# EAGLE design V1.0 (EAGLE 6.3)
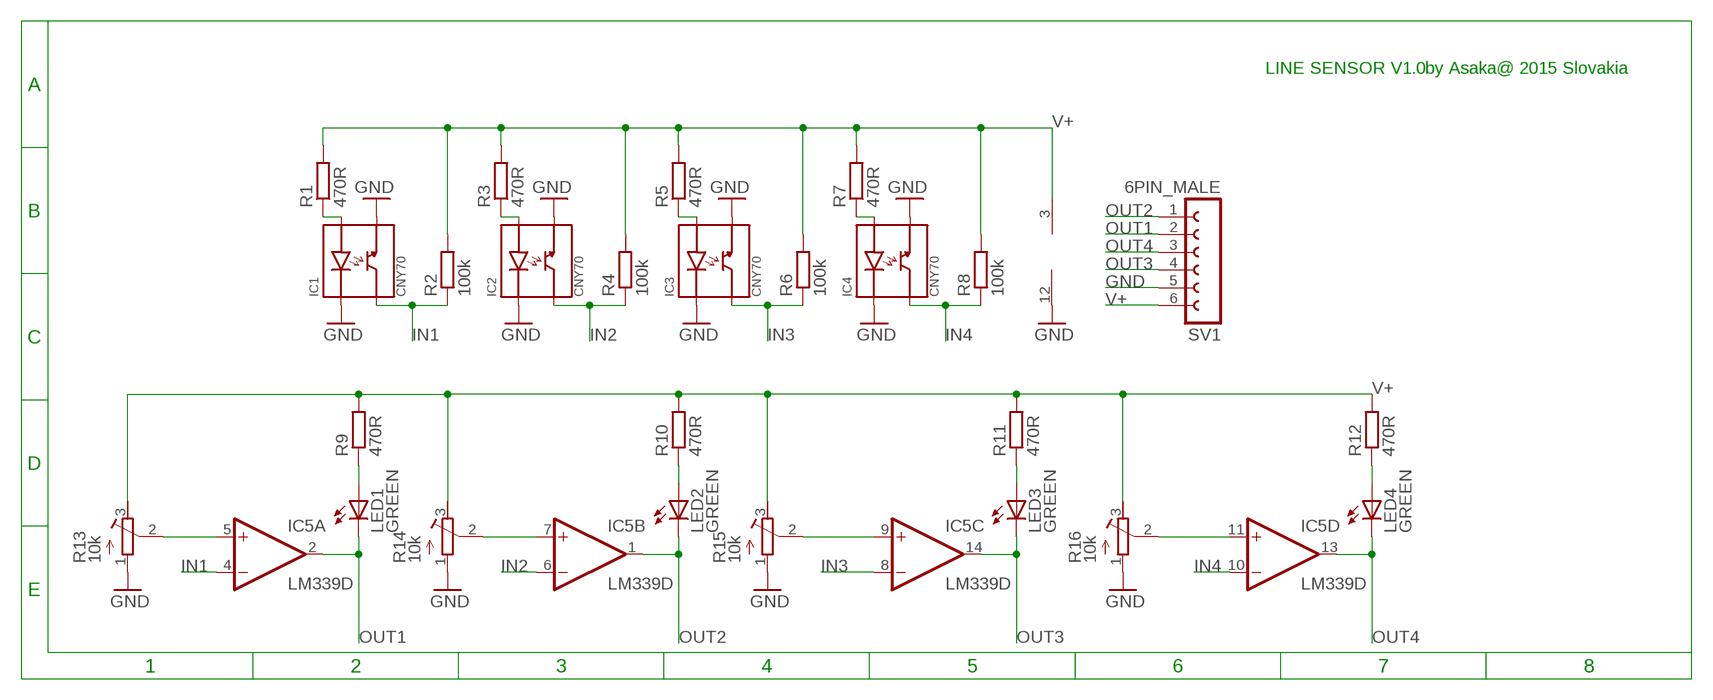
[diagram p0: schematic, sheet 1]

## Parts
IC1  CNY70  [CNY70]
IC2  CNY70  [CNY70]
IC3  CNY70  [CNY70]
IC4  CNY70  [CNY70]
IC5  LM339D  [SO14]
LED1  GREEN  LEDCHIP-LED0805  [CHIP-LED0805]
LED2  GREEN  LEDCHIP-LED0805  [CHIP-LED0805]
LED3  GREEN  LEDCHIP-LED0805  [CHIP-LED0805]
LED4  GREEN  LEDCHIP-LED0805  [CHIP-LED0805]
R1  470R  R-EU_M0805  [M0805]
R2  100k  R-EU_M0805  [M0805]
R3  470R  R-EU_M0805  [M0805]
R4  100k  R-EU_M0805  [M0805]
R5  470R  R-EU_M0805  [M0805]
R6  100k  R-EU_M0805  [M0805]
R7  470R  R-EU_M0805  [M0805]
R8  100k  R-EU_M0805  [M0805]
R9  470R  R-EU_M0805  [M0805]
R10  470R  R-EU_M0805  [M0805]
R11  470R  R-EU_M0805  [M0805]
R12  470R  R-EU_M0805  [M0805]
R13  10k  R-TRIMM3202  [RTRIM3202]
R14  10k  R-TRIMM3202  [RTRIM3202]
R15  10k  R-TRIMM3202  [RTRIM3202]
R16  10k  R-TRIMM3202  [RTRIM3202]
SV1  6PIN_MALE  FE06-1  [FE06]

## Nets
GND: IC1.DE IC1.EK IC2.DE IC2.EK IC3.DE IC3.EK IC4.DE IC4.EK IC5.12(P:GND) R13.1(E) R14.1(E) R15.1(E) R16.1(E) SV1.5
IN1: IC1.DC IC5.4(A:-IN) R2.1
IN2: IC2.DC IC5.6(B:-IN) R4.1
IN3: IC3.DC IC5.8(C:-IN) R6.1
IN4: IC4.DC IC5.10(D:-IN) R8.1
N$2: IC5.5(A:+IN) R13.2(S)
N$4: IC5.7(B:+IN) R14.2(S)
N$6: IC5.9(C:+IN) R15.2(S)
N$8: IC5.11(D:+IN) R16.2(S)
N$13: LED1.A R9.1
N$14: LED2.A R10.1
N$15: LED3.A R11.1
N$16: LED4.A R12.1
N$17: IC1.EA R1.1
N$19: IC2.EA R3.1
N$21: IC3.EA R5.1
N$23: IC4.EA R7.1
OUT1: IC5.2(A:OUT) LED1.C SV1.2
OUT2: IC5.1(B:OUT) LED2.C SV1.1
OUT3: IC5.14(C:OUT) LED3.C SV1.4
OUT4: IC5.13(D:OUT) LED4.C SV1.3
V+: IC5.3(P:V+) R1.2 R2.2 R3.2 R4.2 R5.2 R6.2 R7.2 R8.2 R9.2 R10.2 R11.2 R12.2 R13.3(A) R14.3(A) R15.3(A) R16.3(A) SV1.6

## Notes on the sheet
- LINE SENSOR V1.0 | by Asaka | @ 2015 Slovakia

## Library data of the parts
IC1-IC4 = CNY70:CNY70: CNY70 (Vishay) Reflexkoppler
IC5 = linear:LM339: Low Power Low Offset Voltage Quad Comparators with open collector; LM139/LM239/LM339/LM2901/LM3302
LED1-LED4 = led:LED: LED OSRAM: - CHIPLED LG R971, LG N971, LY N971, LG Q971, LY Q971, LO R971, LY R971 LH N974, LH R974 LS Q976, LO Q976, LY Q976 LO Q996 - Hyper CHIPLED LW Q18S LB Q993, LB Q99A, LB R99A - SideLED LS A670, LO A670, LY A670, LG A670, LP A670 LB A673, LV A673, LT A673, LW A673 LH A674 LY A675 LS A676, LA A676, LO A676, LY A676, LW A676 LS A679, LY A679, LG A679 - Hyper Micro SIDELED® LS Y876, LA Y876, LO Y876, LY Y876 LT Y87S - SmartLED LW L88C, LW L88S LB L89C, LB L89S, LG L890 LS L89K, LO L89K, LY L89K LS L896, LA L896, LO L896, LY L896 - TOPLED LS T670, LO T670, LY T670, LG T670, LP T670 LSG T670, LSP T670, LSY T670, LOP T670, LYG T670 LG T671, LOG T671, LSG T671 LB T673, LV T673, LT T673, LW T673 LH T674 LS T676, LA T676, LO T676, LY T676, LB T676, LH T676, LSB T676, LW T676 LB T67C, LV T67C, LT T67C, LS T67K, LO T67K, LY T67K, LW E67C LS E67B, LA E67B, LO E67B, LY E67B, LB E67C, LV E67C, LT E67C LW T67C LS T679, LY T679, LG T679 LS T770, LO T770, LY T770, LG T770, LP T770 LB T773, LV T773, LT T773, LW T773 LH T774 LS E675, LA E675, LY E675, LS T675 LS T776, LA T776, LO T776, LY T776, LB T776 LHGB T686 LT T68C, LB T68C - Hyper Mini TOPLED® LB M676 - Mini TOPLED Santana® LG M470 LS M47K, LO M47K, LY M47K Source: http://www.osram.convergy.de LUXEON: - LUMILED® LXK2-PW12-R00, LXK2-PW12-S00, LXK2-PW14-U00, LXK2-PW14-V00 LXK2-PM12-R00, LXK2-PM12-S00, LXK2-PM14-U00 LXK2-PE12-Q00, LXK2-PE12-R00, LXK2-PE12-S00, LXK2-PE14-T00, LXK2-PE14-U00 LXK2-PB12-K00, LXK2-PB12-L00, LXK2-PB12-M00, LXK2-PB14-N00, LXK2-PB14-P00, LXK2-PB14-Q00 LXK2-PR12-L00, LXK2-PR12-M00, LXK2-PR14-Q00, LXK2-PR14-R00 LXK2-PD12-Q00, LXK2-PD12-R00, LXK2-PD12-S00 LXK2-PH12-R00, LXK2-PH12-S00 LXK2-PL12-P00, LXK2-PL12-Q00, LXK2-PL12-R00 Source: www.luxeon.com KINGBRIGHT: KA-3528ASYC Source: www.kingbright.com
R1-R12 = resistor:R-EU_: RESISTOR, European symbol
R13-R16 = resistor:R-TRIMM: Trimm resistor
SV1 = con-lsta:FE06-1: FEMALE HEADER; OC_FARNELL: unknown; OC_NEWARK: unknown

## Board
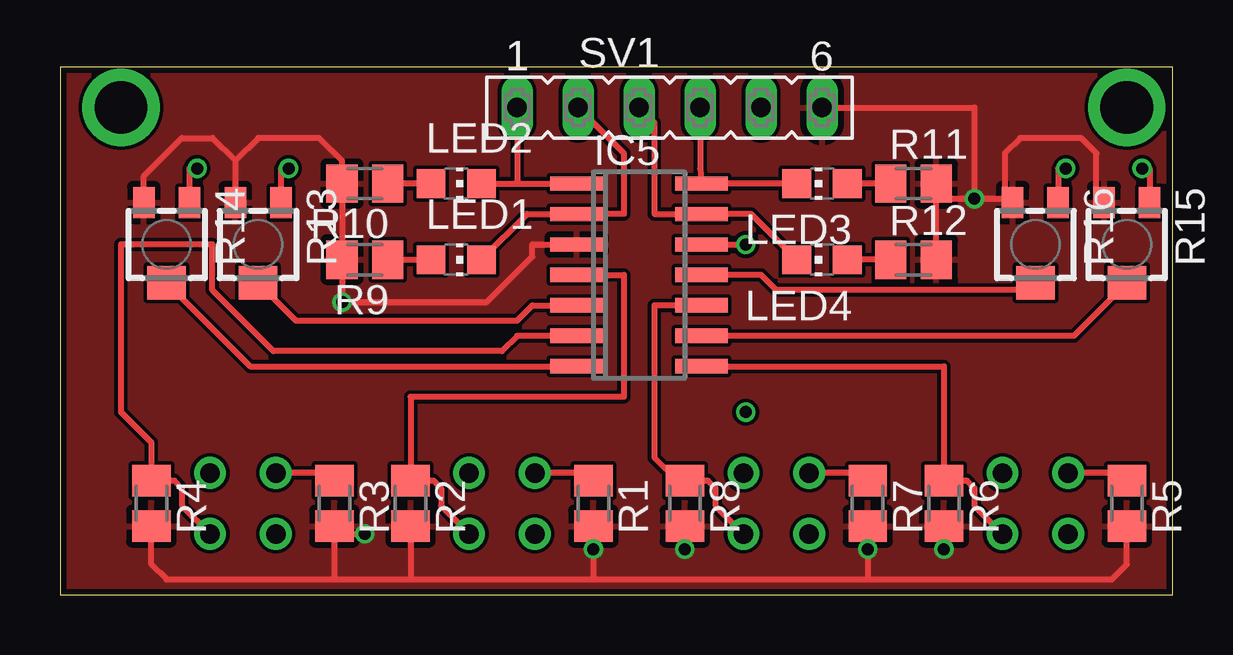
[diagram p1: board, top side]
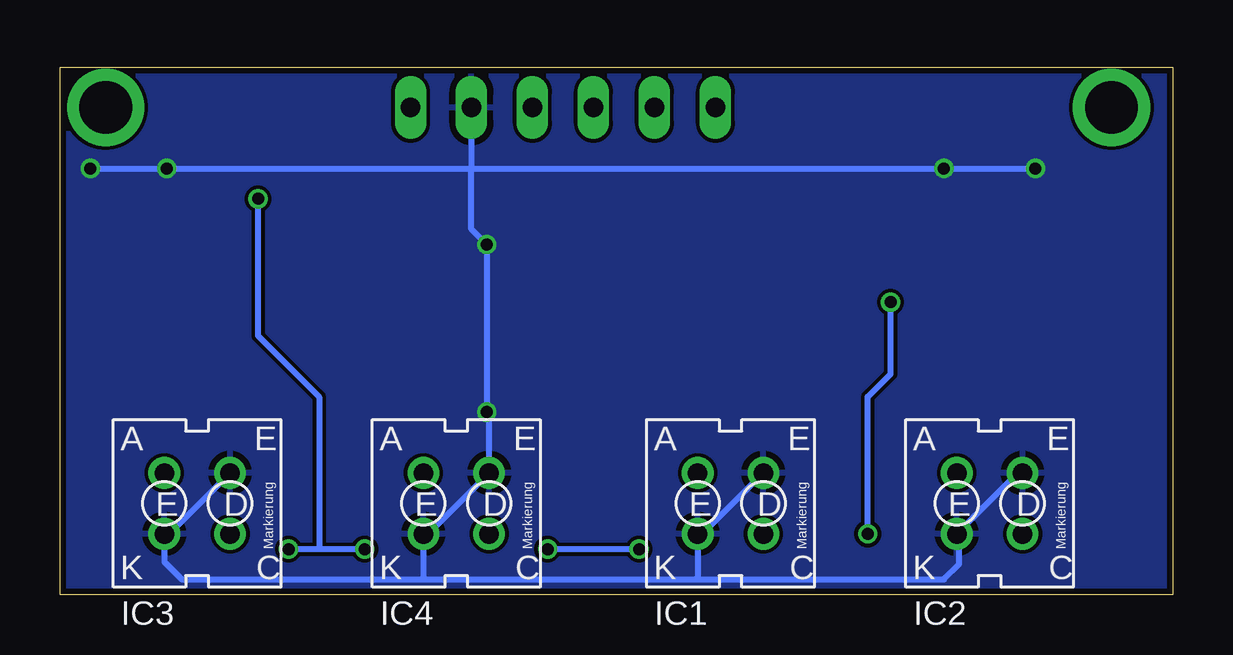
[diagram p2: board, bottom side, seen from below]

Size 46.35 x 22 mm. Coordinates in mm from the lower left corner, seen from the top.
Outline: 0,0 46.35,0 46.35,22 0,22 0,0
Copper layers (1*16): Top 0.035mm / dielectric 1.5mm / Bottom 0.035mm
Design rules "ITEADstudio_DRC *": minimum track width 10mil, minimum drill 12mil, track to track 6mil, track to pad 6mil, pad to pad 6mil, via to via 6mil, smd to smd 0mil, copper to edge 10mil, drill to drill 10mil, minimum pad ring 10mil, minimum via ring 6mil, stop-mask expansion 2mil, vias tented up to drill 100mil, thermal gap 10mil

### Footprints (pad centres in the part's own frame; a part is rotated, then mirrored left to right if it is on the bottom)
CNY70 = drill 0.813: DC 1.37,-1.27; DE 1.37,1.27; EA -1.37,1.27; EK -1.37,-1.27
SO14 = smd 0.6 x 2.2: 1 -3.81,-2.6; 2 -2.54,-2.6; 3 -1.27,-2.6; 4 0,-2.6; 5 1.27,-2.6; 6 2.54,-2.6; 7 3.81,-2.6; 8 3.81,2.6; 9 2.54,2.6; 10 1.27,2.6; 11 0,2.6; 12 -1.27,2.6; 13 -2.54,2.6; 14 -3.81,2.6
CHIP-LED0805 = smd 1.2 x 1.2: A 0,-1.05; C 0,1.05
M0805 = smd 1.3 x 1.6: 1 -0.95,0; 2 0.95,0
RTRIM3202 = smd 0.9 x 1.3: 1 -0.95,-1.75; 3 0.95,-1.75 | smd 1.6 x 1.4: 2 0,1.6
FE06 = drill 0.813 long: 1 -6.35,0; 2 -3.81,0; 3 -1.27,0; 4 1.27,0; 5 3.81,0; 6 6.35,0

### Placement (x,y rotation side)
IC1  18.41,3.81 0 bottom
IC2  7.62,3.81 0 bottom
IC3  40.64,3.81 0 bottom
IC4  29.84,3.81 0 bottom
IC5  24.13,13.34 270 top
LED1  16.51,13.97 270 top
LED2  16.51,17.14 270 top
LED3  31.75,17.14 90 top
LED4  31.75,13.97 90 top
R1  22.23,3.81 270 top
R2  14.61,3.81 270 top
R3  11.43,3.81 270 top
R4  3.81,3.81 270 top
R5  44.45,3.81 270 top
R6  36.83,3.81 270 top
R7  33.66,3.81 270 top
R8  26.04,3.81 270 top
R9  12.7,13.97 180 top
R10  12.7,17.14 180 top
R11  35.56,17.14 0 top
R12  35.56,13.97 0 top
R13  8.26,14.61 180 top
R14  4.45,14.61 180 top
R15  44.45,14.61 180 top
R16  40.64,14.61 180 top
SV1  25.4,20.32 0 top

### Tracks (layer width: path | path; a pad name or v marks a point on that pad's centre or on a via)
GND  (via drill 0.5)
  Top 0.254: v5.71,17.78 5.39,17.78 R14.1 | v9.53,17.78 9.21,17.78 R13.1 | v41.91,17.78 41.59,17.78 R16.1 | v45.09,17.78 45.41,17.78 R15.1 | IC5.12 v28.57,14.61
  Bottom 0.254: SV1.5 29.21,17.78 | 29.21,17.78 v9.53,17.78 v5.71,17.78 | v45.09,17.78 v41.91,17.78 29.21,17.78 | 29.21,17.78 29.21,15.24 v28.57,14.61 v28.57,7.62 28.48,7.52 IC4.DE 31.02,2.54 IC4.EK 31.21,0.73 31.11,0.64 | 31.11,0.64 41.27,0.64 42.01,1.37 IC3.EK 41.81,2.54 IC3.DE | 31.11,0.64 19.68,0.64 | 19.68,0.64 9.53,0.64 8.89,1.27 8.89,2.44 IC2.EK 6.45,5.08 IC2.DE | 19.68,0.64 19.79,0.73 IC1.EK 19.59,2.54 IC1.DE
  pour Bottom: 0,22.23 46.35,22.23 46.35,0 0,0
IN1
  Top 0.254: IC5.4 23.5,13.34 23.5,8.26 14.61,8.26 R2.1 15.56,4.76 15.88,4.45 15.88,3.71 IC1.DC
IN2
  Top 0.254: IC5.6 19.05,10.79 18.41,10.16 8.89,10.16 6.35,12.7 6.35,14.61 2.54,14.61 2.54,7.62 3.81,6.35 R4.1 4.76,4.76 5.08,4.45 5.08,3.71 IC2.DC
IN3
  Top 0.254: IC3.DC 38.1,3.71 38.1,4.45 37.78,4.76 R6.1 36.83,9.53 IC5.8
IN4
  Top 0.254: IC5.10 24.77,12.06 24.77,5.71 25.72,4.76 R8.1 26.99,4.76 27.3,4.45 27.3,3.71 IC4.DC
N$1  (via drill 2.2)
  other vias: 2.54,20.32
N$2
  Top 0.254: R13.2 9.83,11.43 19.05,11.43 19.68,12.06 IC5.5
N$3  (via drill 2.2)
  other vias: 44.45,20.32
N$4
  Top 0.254: R14.2 7.92,9.53 IC5.7
N$6
  Top 0.254: R15.2 42.24,10.79 IC5.9
N$8
  Top 0.254: R16.2 40.34,12.7 29.84,12.7 29.21,13.34 IC5.11
N$13
  Top 0.254: R9.1 LED1.A
N$14
  Top 0.254: LED2.A R10.1
N$15
  Top 0.254: R11.1 LED3.A
N$16
  Top 0.254: R12.1 LED4.A
N$17
  Top 0.254: R1.1 21.91,5.08 IC1.EA
N$19
  Top 0.254: R3.1 11.11,5.08 IC2.EA
N$21
  Top 0.254: R5.1 44.13,5.08 IC3.EA
N$23
  Top 0.254: R7.1 33.34,5.08 IC4.EA
OUT1
  Top 0.254: LED1.C 19.46,15.88 IC5.2 23.5,15.88 23.5,18.41 SV1.2
OUT2
  Top 0.254: LED2.C 19.05,17.14 | 19.05,17.14 IC5.1 | SV1.1 19.05,17.14
OUT3
  Top 0.254: LED3.C IC5.14 26.67,17.78 SV1.4
OUT4
  Top 0.254: LED4.C 28.8,15.88 IC5.13 24.77,15.88 24.77,19.68 SV1.3
V+  (via drill 0.5)
  Top 0.254: 11.43,0.64 4.45,0.64 3.81,1.27 R4.2 | 11.43,0.64 14.61,0.64 | 14.61,0.64 22.23,0.64 | 22.23,0.64 33.66,0.64 | 33.66,0.64 43.81,0.64 44.45,1.27 R5.2 44.77,2.85 | R1.2 v22.23,1.91 22.23,0.64 | R7.2 v33.66,1.91 33.66,0.64 | SV1.6 38.1,20.32 v38.1,16.51 | IC5.3 19.68,14.61 19.68,14.1 17.78,12.2 v11.75,12.2 R9.2 R10.2 11.75,18.09 10.79,19.05 8.26,19.05 7.3,18.09 | 11.43,0.64 R3.2 11.43,2.54 v12.7,2.54 | R2.2 14.61,0.64 | R15.3 43.18,16.36 43.18,18.41 42.55,19.05 40.01,19.05 39.37,18.41 39.37,16.68 R16.3 arc90 39.53,16.51 v38.1,16.51 | R14.3 3.5,17.46 5.08,19.05 6.35,19.05 7.3,18.09 | 7.3,18.09 R13.3 | R12.2 R11.2 37.15,16.51 v38.1,16.51
  Bottom 0.254: v22.23,1.91 v26.04,1.91 | v33.66,1.91 v36.83,1.91 35.56,1.91 35.56,8.26 38.1,10.79 v38.1,16.51 | v12.7,2.54 12.7,8.26 11.75,9.21 v11.75,12.2
  pour Top: 0,22.23 46.35,22.23 46.35,0 0,0